# EAGLE design Ctrl_Joy (EAGLE 9.1.3)
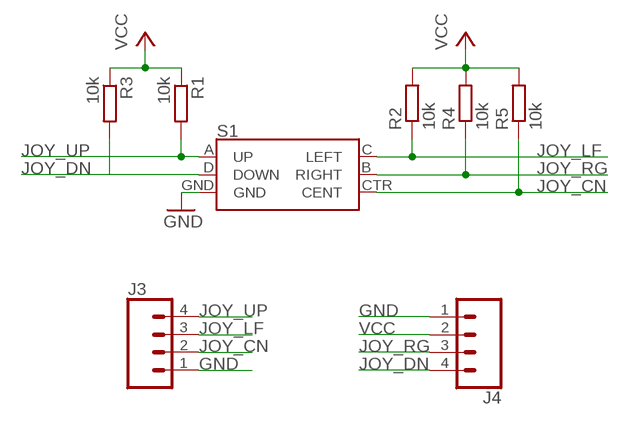
[diagram p0: schematic, sheet 1]

## Parts
J3  CONN_04  [1X04]
J4  CONN_04  [1X04]
R1  10k  R-EU_R0603  [R0603]
R2  10k  R-EU_R0603  [R0603]
R3  10k  R-EU_R0603  [R0603]
R4  10k  R-EU_R0603  [R0603]
R5  10k  R-EU_R0603  [R0603]
S1  JOYSTICK_MINI  [JOYSTICK_MINI]

## Nets
GND: J3.1 J4.1 S1.GND
JOY_CN: J3.2 R5.1 S1.CTR(CENT)
JOY_DN: J4.4 R3.2 S1.D(DOWN)
JOY_LF: J3.3 R2.1 S1.C(LEFT)
JOY_RG: J4.3 R4.1 S1.B(RIGHT)
JOY_UP: J3.4 R1.2 S1.A(UP)
VCC: J4.2 R1.1 R2.2 R3.1 R4.2 R5.2

## Library data of the parts
J3 J4 = SparkFun-Connectors:CONN_04: Multi connection point. Often used as Generic Header-pin footprint for 0.1 inch spaced/style header connections On any of the 0.1 inch spaced packages, you can populate with these: Break Away Headers - Straight <https://www.sparkfun.com/products/116> (PRT-00116) Break Away Male Headers - Right Angle <https://www.sparkfun.com/products/553> (PRT-00553) Female Headers <https://www.sparkfun.com/products/115> (PRT-00115) Break Away Headers - Machine Pin <https://www.sparkfun.com/products/117> (PRT-00117) Break Away Female Headers - Swiss Machine Pin <https://www.sparkfun.com/products/743> (PRT-00743) For SCREWTERMINALS and SPRING TERMINALS visit here: Screw Terimnals on SparkFun.com <https://www.sparkfun.com/search/results?term=Screw+Terminals> (5mm/3.5mm/2.54mm spacing) This device is also useful as a general connection point to wire up your design to another part of your project. Our various solder wires solder well into these plated through hole pads. Hook-Up Wire - Assortment (Stranded, 22 AWG) <https://www.sparkfun.com/products/11375> (PRT-11375) Hook-Up Wire - Assortment (Solid Core, 22 AWG) <https://www.sparkfun.com/products/11367> (PRT-11367) View the entire wire category on our website here <https://www.sparkfun.com/categories/141> Special notes: Molex polarized connector foot print use with SKU : PRT-08231 with associated crimp pins and housings. 1MM SMD Version SKU: PRT-10208; PROD_ID: CONN-09696
R1-R5 = resistor:R-EU_: RESISTOR, European symbol
S1 = SparkFun-Switches:JOYSTICK_MINI: Small Tactile Joystick w/ Select Switch A 5-way tactile switch allows for a joystick-like interface in a very small package. Part #: 4UCON SF303GJ26 SparkFun Products 5-way Tactile Switch <https://www.sparkfun.com/products/10063> (COM-10063) Used on SparkFun Block for Intel® Edison - OLED <https://www.sparkfun.com/products/13035> (DEV-13035) Used on CAN-BUS Shield <https://www.sparkfun.com/products/13262> (DEV-13262); PROD_ID: SWCH-09905; SF_SKU: COM-10063

## Board
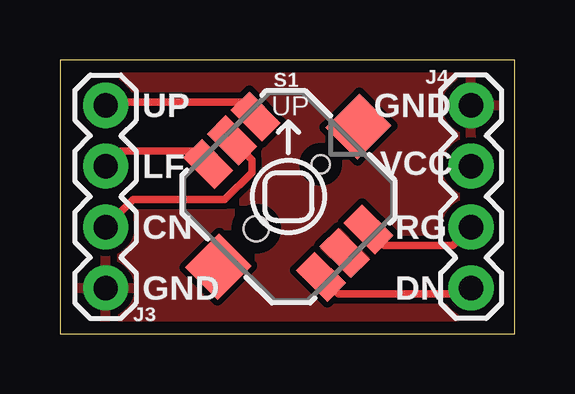
[diagram p1: board, top side]
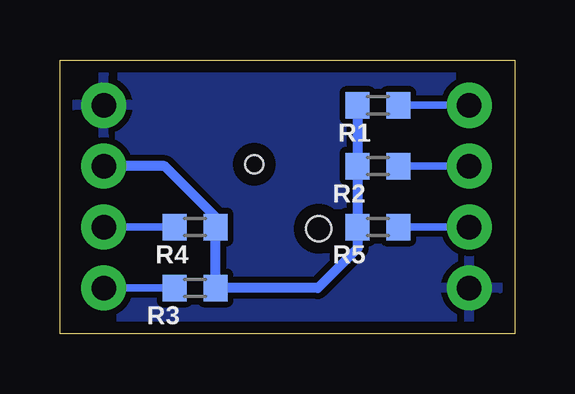
[diagram p2: board, bottom side, seen from below]

Size 18.97 x 11.42 mm. Coordinates in mm from the lower left corner, seen from the top.
Outline: 0,0 18.97,0 18.97,11.42 0,11.42 0,0
Copper layers (1*16): Top 0.035mm / dielectric 1.5mm / Bottom 0.035mm
Design rules "default *": minimum track width 6mil, minimum drill 0.35mm, track to track 10mil, track to pad 10mil, pad to pad 10mil, via to via 10mil, smd to smd 10mil, copper to edge 20mil, drill to drill 6mil, minimum pad ring 10mil, minimum via ring 8mil, stop-mask expansion 4mil, vias tented up to drill 0mil, thermal gap 10mil

### Footprints (pad centres in the part's own frame; a part is rotated, then mirrored left to right if it is on the bottom)
1X04 = drill 1.016 pad 1.88: 1 0,0; 2 2.54,0; 3 5.08,0; 4 7.62,0
R0603 = smd 1 x 1.1: 1 -0.85,0; 2 0.85,0
JOYSTICK_MINI = smd 1.85 x 1.1: A -3.325,1.4; B 3.325,1.4; C -3.325,-1.4; CTR -3.325,0; D 3.325,-1.4; GND 3.325,0 | smd 1.9 x 2: NC 0,4.13; NC@0 0,-4.13 | hole 0.75: 0,1.9 | hole 1.05: 0,-1.9

### Placement (x,y rotation side)
J3  1.9,1.9 90 top
J4  17.14,9.53 270 top
R1  5.71,9.53 0 bottom
R2  5.71,6.98 180 bottom
R3  13.34,1.9 180 bottom
R4  13.34,4.45 0 bottom
R5  5.71,4.45 180 bottom
S1  9.53,5.71 315 top

### Tracks (layer width: path | path; a pad name or v marks a point on that pad's centre or on a via)
GND
  pour Bottom: -0.64,12.07 -0.64,-0.64 19.68,-0.64 19.68,12.07
  pour Top: -0.64,12.07 -0.64,-0.64 19.68,-0.64 19.68,12.07
JOY_CN
  Top 0.305: S1.CTR 8,7.24 8,6.73 6.86,5.59 4.45,5.59 3.05,5.59 J3.2
  Bottom 0.305: J3.2 R5.1
JOY_DN
  Top 0.305: S1.D 11.61,1.65 16.89,1.65 J4.4
  Bottom 0.305: R3.2 J4.4
JOY_LF
  Top 0.305: S1.C 5.64,7.62 2.54,7.62 J3.3
  Bottom 0.305: J3.3 R2.1
JOY_RG
  Top 0.305: S1.B 13.54,3.68 16.38,3.68 J4.3
  Bottom 0.305: J4.3 R4.1
JOY_UP
  Top 0.305: S1.A 7.57,9.65 2.03,9.65 J3.4
  Bottom 0.305: J3.4 R1.2
VCC
  Bottom 0.406: R1.1 R2.2 R5.2 6.56,3.56 8.22,1.9 R3.1 R4.2 12.48,4.87 14.61,6.98 J4.2

### Text on the board
tPlace: UP | GND | LF | VCC | CN | RG | GND | DN